# EAGLE schematic FEEDERLINK (EAGLE 9.5.2)
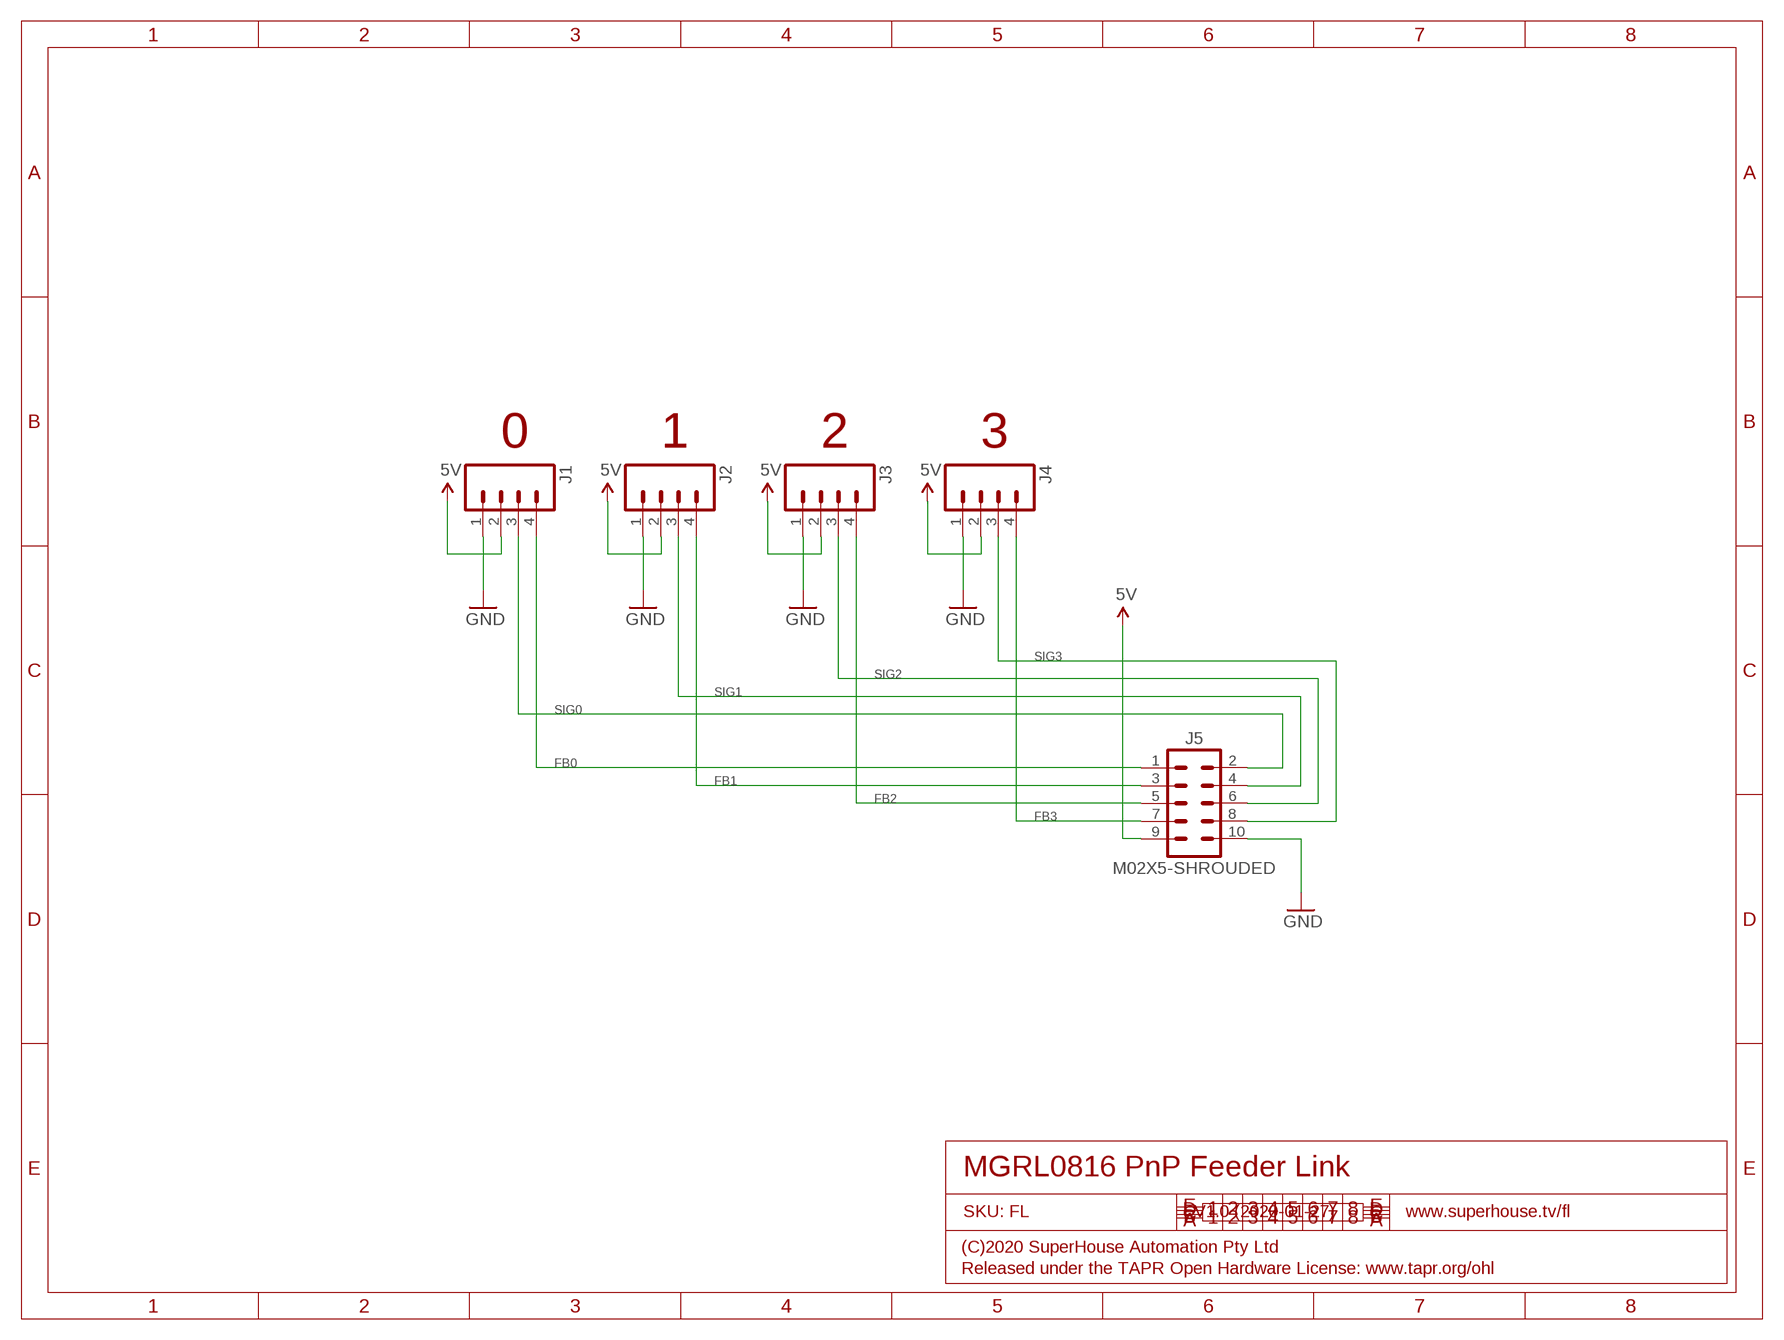
[diagram p0: schematic, sheet 1]

## Parts
J1  M04-SOCKET  [1X04-S]
J2  M04-SOCKET  [1X04-S]
J3  M04-SOCKET  [1X04-S]
J4  M04-SOCKET  [1X04-S]
J5  M02X5-SHROUDED  [2X05-2.54-SHROUDED]

## Nets
5V: J1.2 J2.2 J3.2 J4.2 J5.9
FB0: J1.4 J5.1
FB1: J2.4 J5.3
FB2: J3.4 J5.5
FB3: J4.4 J5.7
GND: J1.1 J2.1 J3.1 J4.1 J5.10
SIG0: J1.3 J5.2
SIG1: J2.3 J5.4
SIG2: J3.3 J5.6
SIG3: J4.3 J5.8

## Notes on the sheet
- 0 | 1 | 2 | 3
- MGRL0816 PnP Feeder Link
- SKU: FL | V1.0 (2020-01-27) | www.superhouse.tv/fl
- (C)2020 SuperHouse Automation Pty Ltd
- Released under the TAPR Open Hardware License: www.tapr.org/ohl

## Library data of the parts
J1-J4 = SuperHouse-Connectors:M04: 4-way header Standard 1x4 header, and screw terminal variations
J5 = SuperHouse-Connectors:M02X5: M10 header in 2x5 format